# Altium schematic sheet USB_OUT_A.SchDoc
size A; SheetNumber: 11; SheetTotal: 12
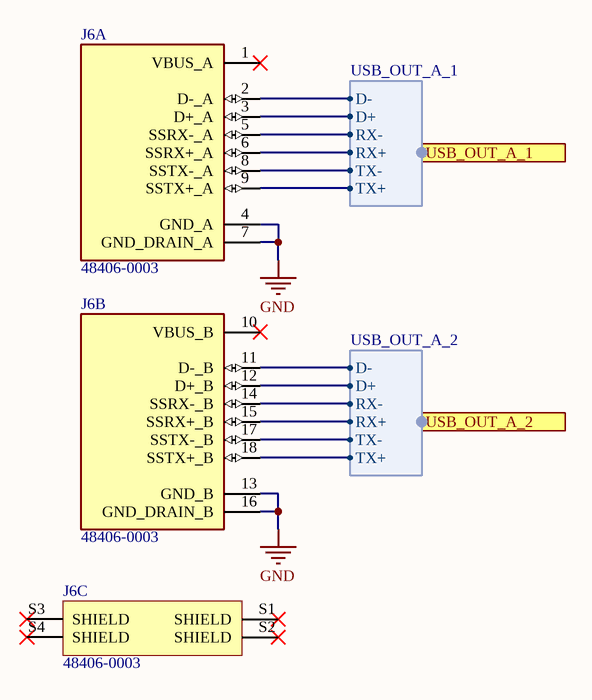
[diagram p0: USB_OUT_A.SchDoc]

## Parts
J6  48406-0003  [MOLEX_48406]  (parts A,B,C of 3)

## Ports
USB_OUT_A_1 (harness USB_OUT_A_1, see USB[3B], USB_SWITCH_A[3B]), USB_OUT_A_2 (harness USB_OUT_A_2, see USB[3B], USB_SWITCH_A[3B])

## Harnesses
USB_OUT_A_1: D+, D-, RX-, RX+, TX-, TX+
USB_OUT_A_2: D+, D-, RX-, RX+, TX-, TX+

## Nets
GND: J6.4(GND_A) J6.7(GND_DRAIN_A) J6.13(GND_B) J6.16(GND_DRAIN_B)
NetJ6_2: J6.2(D-_A) ; port USB_OUT_A_1.D-
NetJ6_3: J6.3(D+_A) ; port USB_OUT_A_1.D+
NetJ6_5: J6.5(SSRX-_A) ; port USB_OUT_A_1.RX-
NetJ6_6: J6.6(SSRX+_A) ; port USB_OUT_A_1.RX+
NetJ6_8: J6.8(SSTX-_A) ; port USB_OUT_A_1.TX-
NetJ6_9: J6.9(SSTX+_A) ; port USB_OUT_A_1.TX+
NetJ6_11: J6.11(D-_B) ; port USB_OUT_A_2.D-
NetJ6_12: J6.12(D+_B) ; port USB_OUT_A_2.D+
NetJ6_14: J6.14(SSRX-_B) ; port USB_OUT_A_2.RX-
NetJ6_15: J6.15(SSRX+_B) ; port USB_OUT_A_2.RX+
NetJ6_17: J6.17(SSTX-_B) ; port USB_OUT_A_2.TX-
NetJ6_18: J6.18(SSTX+_B) ; port USB_OUT_A_2.TX+

Not connected (* = marked no-connect by the designer): J6 1(VBUS_A)* 10(VBUS_B)* S1(SHIELD)* S2(SHIELD)* S3(SHIELD)* S4(SHIELD)*

## Library data of the parts
J6 = 48406-0003: USB-A (USB TYPE-A), Stacked USB 3.2 Gen 1 (USB 3.1 Gen 1, Superspeed (USB 3.0)) Receptacle Connector 18 Position Through Hole, Right Angle; MF: Molex; Package: None; Check_prices: https://www.snapeda.com/parts/48406-0003/Molex/view-part/?ref=eda; Value: *; Price: None; MP: 48406-0003; Purchase-URL: https://pricing.snapeda.com/search/part/48406-0003/?ref=eda; SnapEDA_Link: https://www.snapeda.com/parts/48406-0003/Molex/view-part/?ref=snap; Availability: In Stock